# EAGLE design buscontroller (EAGLE 5.06)
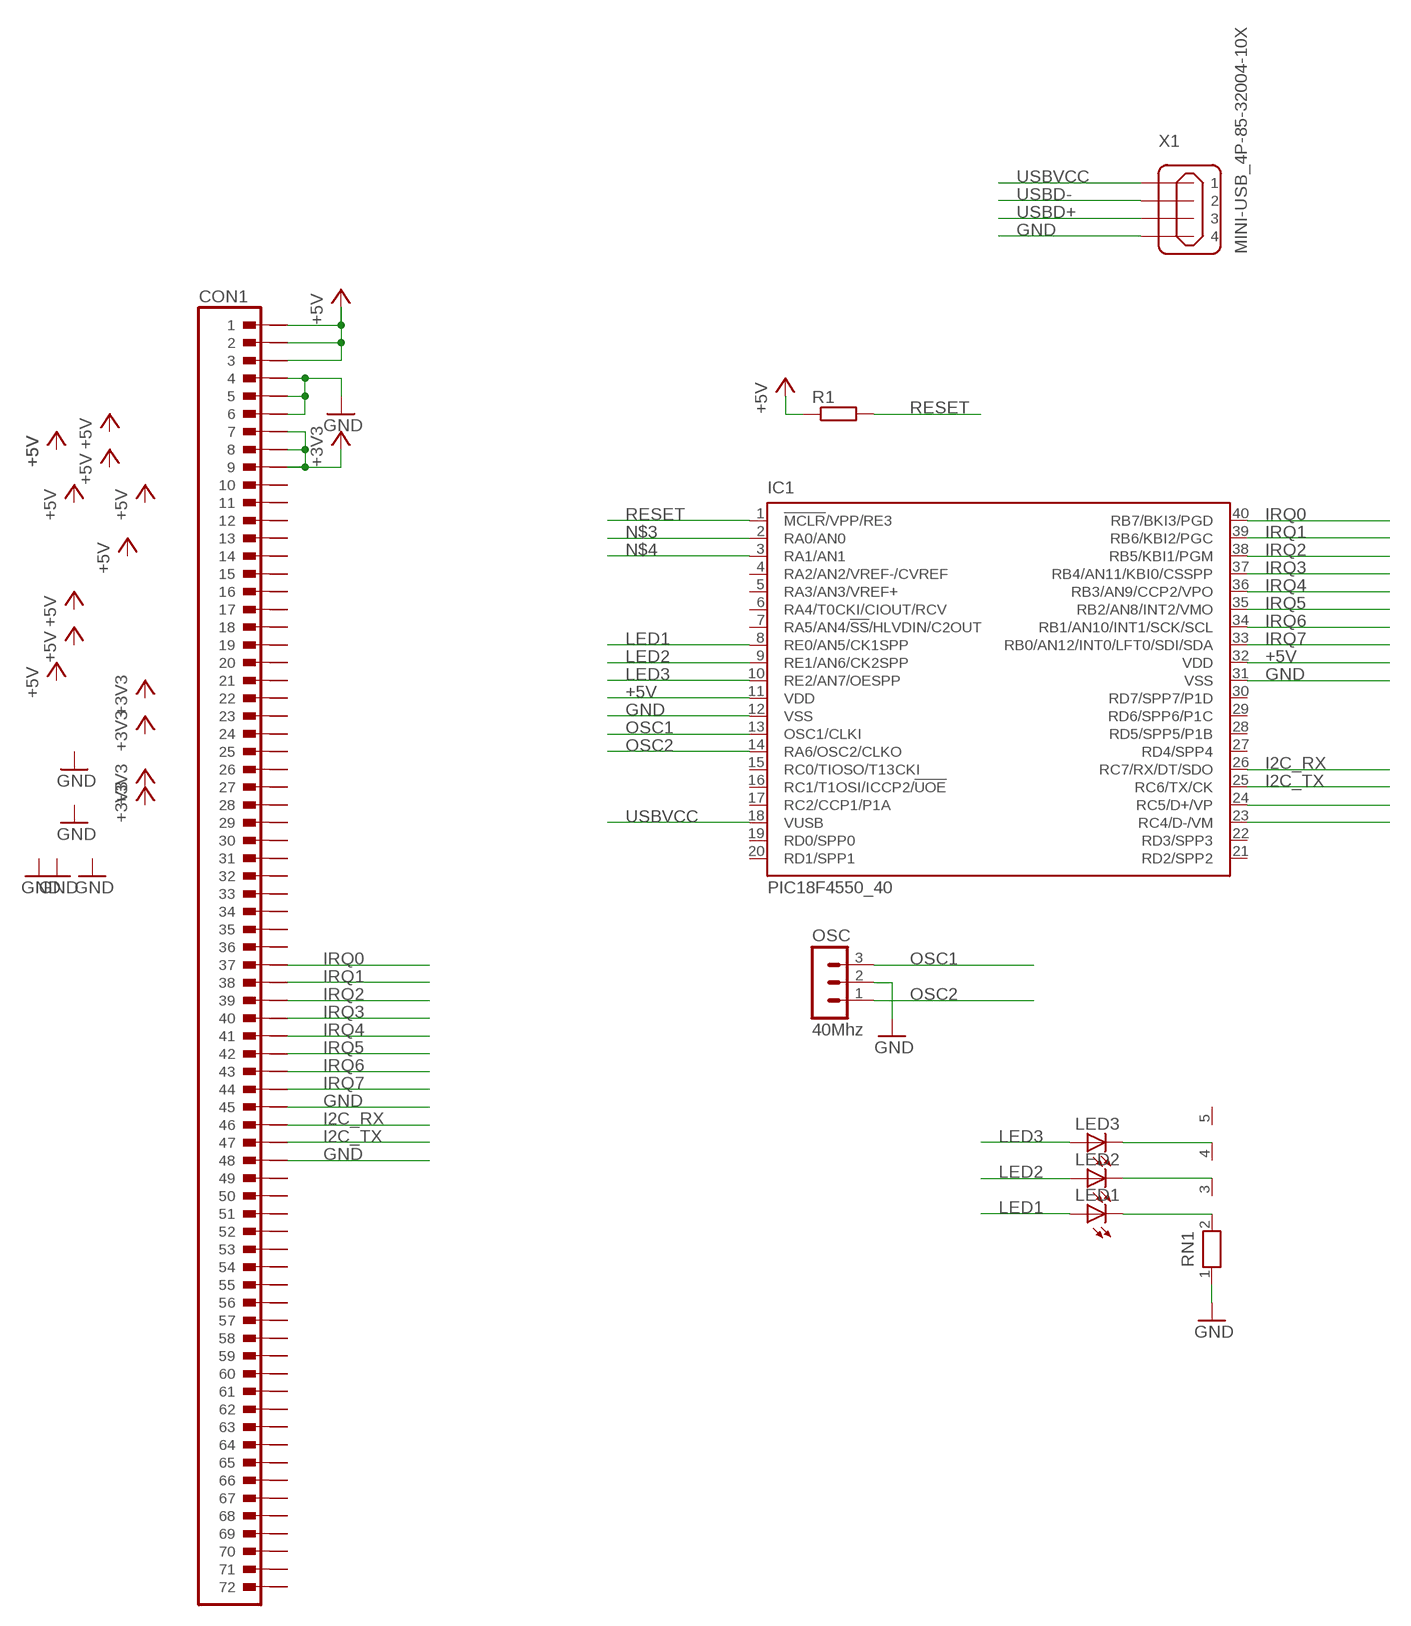
[diagram p0: schematic, sheet 1]

## Parts
CON1  SIMII72  [SIMM72R]
IC1  PIC18F4550_40  [DIL40]
LED1  LEDB155  [Q62902-B155]
LED2  LEDB155  [Q62902-B155]
LED3  LEDB155  [Q62902-B155]
OSC  40Mhz  MA03-1  [MA03-1]
R1  R-EU_0207/10  [0207/10]
RN1  RN04  [RN-5]
X1  MINI-USB_4P-85-32004-10X  [85-32004-10X]

## Nets
+3V3: CON1.7 CON1.8 CON1.9
+5V: CON1.1 CON1.2 CON1.3 IC1.11(VDD) IC1.32(VDD) R1.1
GND: CON1.4 CON1.5 CON1.6 CON1.45 CON1.48 IC1.12(VSS) IC1.31(VSS) OSC.2 RN1.1 X1.4
I2C_RX: CON1.46 IC1.26(RC7/RX/DT/SDO)
I2C_TX: CON1.47 IC1.25(RC6/TX/CK)
IRQ0: CON1.37 IC1.40(RB7/BKI3/PGD)
IRQ1: CON1.38 IC1.39(RB6/KBI2/PGC)
IRQ2: CON1.39 IC1.38(RB5/KBI1/PGM)
IRQ3: CON1.40 IC1.37(RB4/AN11/KBI0/CSSPP)
IRQ4: CON1.41 IC1.36(RB3/AN9/CCP2/VPO)
IRQ5: CON1.42 IC1.35(RB2/AN8/INT2/VMO)
IRQ6: CON1.43 IC1.34(RB1/AN10/INT1/SCK/SCL)
IRQ7: CON1.44 IC1.33(RB0/AN12/INT0/LFT0/SDI/SDA)
LED1: IC1.8(RE0/AN5/CK1SPP) LED1.A
LED2: IC1.9(RE1/AN6/CK2SPP) LED2.A
LED3: IC1.10(RE2/AN7/OESPP) LED3.A
N$1: LED1.K(C) RN1.2
N$2: LED2.K(C) RN1.3
N$3: IC1.2(RA0/AN0)
N$4: IC1.3(RA1/AN1)
N$5: LED3.K(C) RN1.4
OSC1: IC1.13(OSC1/CLKI) OSC.3
OSC2: IC1.14(RA6/OSC2/CLKO) OSC.1
RESET: IC1.1(!MCLR!/VPP/RE3) R1.2
USBD+: IC1.24(RC5/D+/VP) X1.3
USBD-: IC1.23(RC4/D-/VM) X1.2
USBVCC: IC1.18(VUSB) X1.1
Unconnected: CON1.10 CON1.11 CON1.12 CON1.13 CON1.14 CON1.15 CON1.16 CON1.17 CON1.18 CON1.19 CON1.20 CON1.21 CON1.22 CON1.23 CON1.24 CON1.25 CON1.26 CON1.27 CON1.28 CON1.29 CON1.30 CON1.31 CON1.32 CON1.33 CON1.34 CON1.35 CON1.36 CON1.49 CON1.50 CON1.51 CON1.52 CON1.53 CON1.54 CON1.55 CON1.56 CON1.57 CON1.58 CON1.59 CON1.60 CON1.61 CON1.62 CON1.63 CON1.64 CON1.65 CON1.66 CON1.67 CON1.68 CON1.69 CON1.70 CON1.71 CON1.72 CON1.73 CON1.74 CON1.75 CON1.76 CON1.77 CON1.78 CON1.79 CON1.80 CON1.81 CON1.82 CON1.83 CON1.84 CON1.85 CON1.86 CON1.87 CON1.88 CON1.89 CON1.90 CON1.91 CON1.92 CON1.93 CON1.94 CON1.95 CON1.96 CON1.97 CON1.98 CON1.99 CON1.100 CON1.101 CON1.102 CON1.103 CON1.104 CON1.105 CON1.106 CON1.107 CON1.108 CON1.109 CON1.110 CON1.111 CON1.112 CON1.113 CON1.114 CON1.115 CON1.116 CON1.117 CON1.118 CON1.119 CON1.120 CON1.121 CON1.122 CON1.123 CON1.124 CON1.125 CON1.126 CON1.127 CON1.128 CON1.129 CON1.130 CON1.131 CON1.132 CON1.133 CON1.134 CON1.135 CON1.136 CON1.137 CON1.138 CON1.139 CON1.140 CON1.141 CON1.142 CON1.143 CON1.144 IC1.4(RA2/AN2/VREF-/CVREF) IC1.5(RA3/AN3/VREF+) IC1.6(RA4/T0CKI/CIOUT/RCV) IC1.7(RA5/AN4/!SS!/HLVDIN/C2OUT) IC1.15(RC0/TIOSO/T13CKI) IC1.16(RC1/T1OSI/ICCP2/!UOE) IC1.17(RC2/CCP1/P1A) IC1.19(RD0/SPP0) IC1.20(RD1/SPP1) IC1.21(RD2/SPP2) IC1.22(RD3/SPP3) IC1.27(RD4/SPP4) IC1.28(RD5/SPP5/P1B) IC1.29(RD6/SPP6/P1C) IC1.30(RD7/SPP7/P1D) RN1.5

## Library data of the parts
CON1 = con-amp:SIMII72: AMP connector
IC1 = microchip:PIC18F4*_40: USB Microcontrollers with nanoWatt Technology High-Performance, Enhanced Flash, 28/40/44-Pin, Source: http://ww1.microchip.com/downloads/en/devicedoc/39632c.pdf
LED1-LED3 = led:LED: LED OSRAM: - CHIPLED LG R971, LG N971, LY N971, LG Q971, LY Q971, LO R971, LY R971 LH N974, LH R974 LS Q976, LO Q976, LY Q976 LO Q996 - Hyper CHIPLED LW Q18S LB Q993, LB Q99A, LB R99A - SideLED LS A670, LO A670, LY A670, LG A670, LP A670 LB A673, LV A673, LT A673, LW A673 LH A674 LY A675 LS A676, LA A676, LO A676, LY A676, LW A676 LS A679, LY A679, LG A679 - Hyper Micro SIDELED® LS Y876, LA Y876, LO Y876, LY Y876 LT Y87S - SmartLED LW L88C, LW L88S LB L89C, LB L89S, LG L890 LS L89K, LO L89K, LY L89K LS L896, LA L896, LO L896, LY L896 - TOPLED LS T670, LO T670, LY T670, LG T670, LP T670 LSG T670, LSP T670, LSY T670, LOP T670, LYG T670 LG T671, LOG T671, LSG T671 LB T673, LV T673, LT T673, LW T673 LH T674 LS T676, LA T676, LO T676, LY T676, LB T676, LH T676, LSB T676, LW T676 LB T67C, LV T67C, LT T67C, LS T67K, LO T67K, LY T67K, LW E67C LS E67B, LA E67B, LO E67B, LY E67B, LB E67C, LV E67C, LT E67C LW T67C LS T679, LY T679, LG T679 LS T770, LO T770, LY T770, LG T770, LP T770 LB T773, LV T773, LT T773, LW T773 LH T774 LS E675, LA E675, LY E675, LS T675 LS T776, LA T776, LO T776, LY T776, LB T776 LHGB T686 LT T68C, LB T68C - Hyper Mini TOPLED® LB M676 - Mini TOPLED Santana® LG M470 LS M47K, LO M47K, LY M47K Source: http://www.osram.convergy.de LUXEON: - LUMILED® LXK2-PW12-R00, LXK2-PW12-S00, LXK2-PW14-U00, LXK2-PW14-V00 LXK2-PM12-R00, LXK2-PM12-S00, LXK2-PM14-U00 LXK2-PE12-Q00, LXK2-PE12-R00, LXK2-PE12-S00, LXK2-PE14-T00, LXK2-PE14-U00 LXK2-PB12-K00, LXK2-PB12-L00, LXK2-PB12-M00, LXK2-PB14-N00, LXK2-PB14-P00, LXK2-PB14-Q00 LXK2-PR12-L00, LXK2-PR12-M00, LXK2-PR14-Q00, LXK2-PR14-R00 LXK2-PD12-Q00, LXK2-PD12-R00, LXK2-PD12-S00 LXK2-PH12-R00, LXK2-PH12-S00 LXK2-PL12-P00, LXK2-PL12-Q00, LXK2-PL12-R00 Source: www.luxeon.com KINGBRIGHT: KA-3528ASYC Source: www.kingbright.com
OSC = con-lstb:MA03-1: PIN HEADER
R1 = rcl:R-EU_: RESISTOR, European symbol
RN1 = resistor-net:RN04: RESISTOR NETWORK
X1 = con-cypressindustries:MINI-USB_4P-: MINI USB 4 Pol. Source: www.cypressindustries.com

## Board
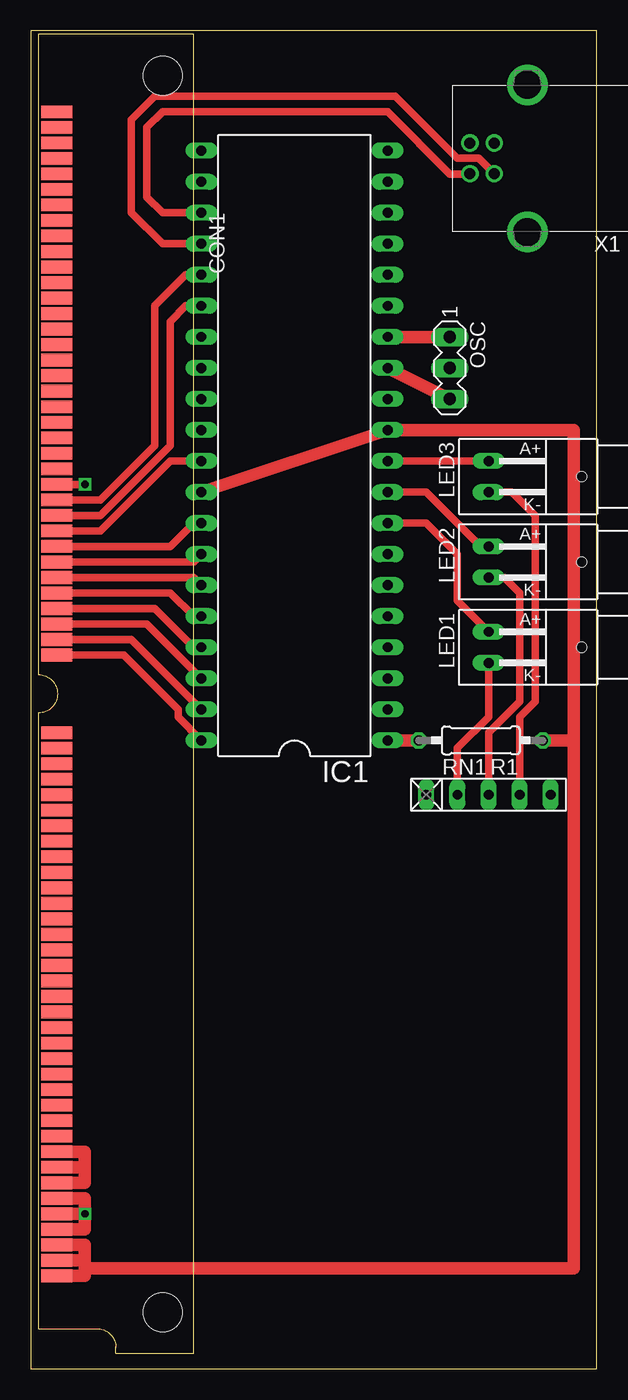
[diagram p1: board, top side]
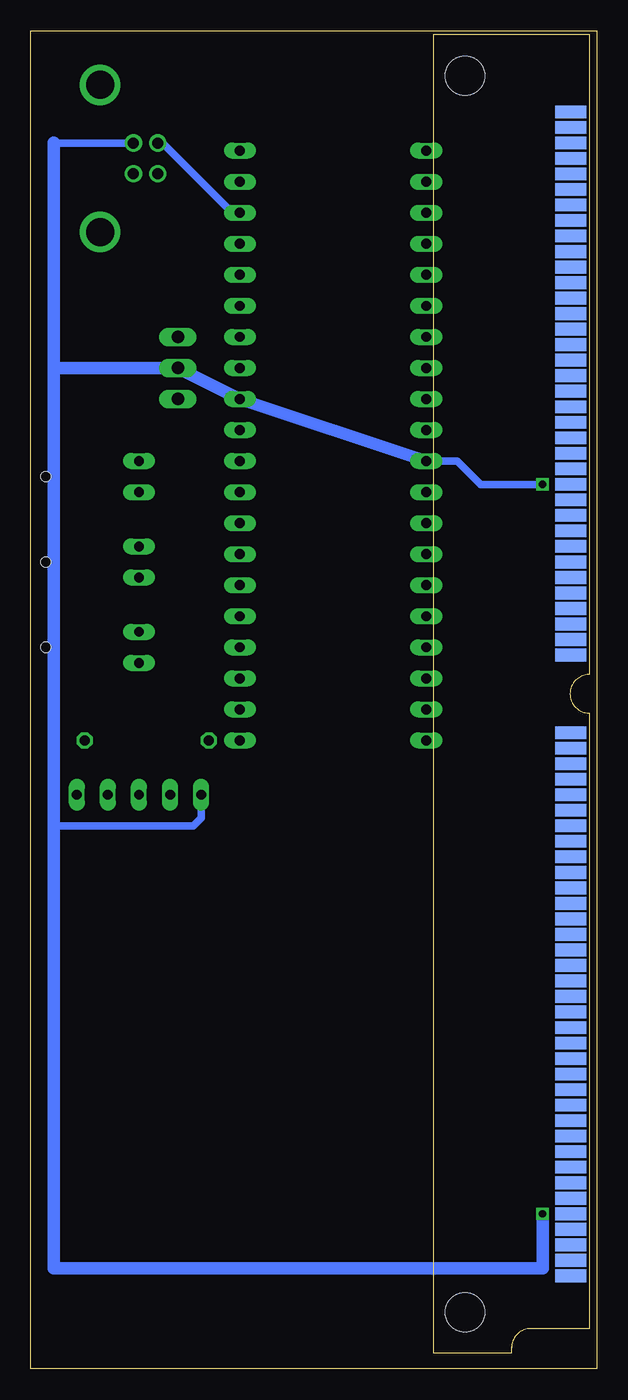
[diagram p2: board, bottom side, seen from below]

Size 46.34 x 109.53 mm. Coordinates in mm from the lower left corner, seen from the top.
Outline: 0,0 46.34,0 46.34,109.53 0,109.53 0,0
Copper layers (1*16): Top 0.035mm / dielectric 1.5mm / Bottom 0.035mm
Design rules "default": minimum track width 10mil, minimum drill 24mil, track to track 8mil, track to pad 8mil, pad to pad 8mil, via to via 8mil, smd to smd 8mil, copper to edge 40mil, drill to drill 8mil, minimum pad ring 10mil, minimum via ring 8mil, stop-mask expansion 4mil, vias tented up to drill 0mil, thermal gap 10mil

### Footprints (pad centres in the part's own frame; a part is rotated, then mirrored left to right if it is on the bottom)
SIMM72R = smd 1.041 x 2.54: 1 47.625,-8.636; 2 46.355,-8.636; 3 45.085,-8.636; 4 43.815,-8.636; 5 42.545,-8.636; 6 41.275,-8.636; 7 40.005,-8.636; 8 38.735,-8.636; 9 37.465,-8.636; 10 36.195,-8.636; 11 34.925,-8.636; 12 33.655,-8.636; 13 32.385,-8.636; 14 31.115,-8.636; 15 29.845,-8.636; 16 28.575,-8.636; 17 27.305,-8.636; 18 26.035,-8.636; 19 24.765,-8.636; 20 23.495,-8.636; 21 22.225,-8.636; 22 20.955,-8.636; 23 19.685,-8.636; 24 18.415,-8.636; 25 17.145,-8.636; 26 15.875,-8.636; 27 14.605,-8.636; 28 13.335,-8.636; 29 12.065,-8.636; 30 10.795,-8.636; 31 9.525,-8.636; 32 8.255,-8.636; 33 6.985,-8.636; 34 5.715,-8.636; 35 4.445,-8.636; 36 3.175,-8.636; 37 -3.175,-8.636; 38 -4.445,-8.636; 39 -5.715,-8.636; 40 -6.985,-8.636; 41 -8.255,-8.636; 42 -9.525,-8.636; 43 -10.795,-8.636; 44 -12.065,-8.636; 45 -13.335,-8.636; 46 -14.605,-8.636; 47 -15.875,-8.636; 48 -17.145,-8.636; 49 -18.415,-8.636; 50 -19.685,-8.636; 51 -20.955,-8.636; 52 -22.225,-8.636; 53 -23.495,-8.636; 54 -24.765,-8.636; 55 -26.035,-8.636; 56 -27.305,-8.636; 57 -28.575,-8.636; 58 -29.845,-8.636; 59 -31.115,-8.636; 60 -32.385,-8.636; 61 -33.655,-8.636; 62 -34.925,-8.636; 63 -36.195,-8.636; 64 -37.465,-8.636; 65 -38.735,-8.636; 66 -40.005,-8.636; 67 -41.275,-8.636; 68 -42.545,-8.636; 69 -43.815,-8.636; 70 -45.085,-8.636; 71 -46.355,-8.636; 72 -47.625,-8.636 | smd 1.041 x 2.54 bottom: 73 47.625,-8.636; 74 46.355,-8.636; 75 45.085,-8.636; 76 43.815,-8.636; 77 42.545,-8.636; 78 41.275,-8.636; 79 40.005,-8.636; 80 38.735,-8.636; 81 37.465,-8.636; 82 36.195,-8.636; 83 34.925,-8.636; 84 33.655,-8.636; 85 32.385,-8.636; 86 31.115,-8.636; 87 29.845,-8.636; 88 28.575,-8.636; 89 27.305,-8.636; 90 26.035,-8.636; 91 24.765,-8.636; 92 23.495,-8.636; 93 22.225,-8.636; 94 20.955,-8.636; 95 19.685,-8.636; 96 18.415,-8.636; 97 17.145,-8.636; 98 15.875,-8.636; 99 14.605,-8.636; 100 13.335,-8.636; 101 12.065,-8.636; 102 10.795,-8.636; 103 9.525,-8.636; 104 8.255,-8.636; 105 6.985,-8.636; 106 5.715,-8.636; 107 4.445,-8.636; 108 3.175,-8.636; 109 -3.175,-8.636; 110 -4.445,-8.636; 111 -5.715,-8.636; 112 -6.985,-8.636; 113 -8.255,-8.636; 114 -9.525,-8.636; 115 -10.795,-8.636; 116 -12.065,-8.636; 117 -13.335,-8.636; 118 -14.605,-8.636; 119 -15.875,-8.636; 120 -17.145,-8.636; 121 -18.415,-8.636; 122 -19.685,-8.636; 123 -20.955,-8.636; 124 -22.225,-8.636; 125 -23.495,-8.636; 126 -24.765,-8.636; 127 -26.035,-8.636; 128 -27.305,-8.636; 129 -28.575,-8.636; 130 -29.845,-8.636; 131 -31.115,-8.636; 132 -32.385,-8.636; 133 -33.655,-8.636; 134 -34.925,-8.636; 135 -36.195,-8.636; 136 -37.465,-8.636; 137 -38.735,-8.636; 138 -40.005,-8.636; 139 -41.275,-8.636; 140 -42.545,-8.636; 141 -43.815,-8.636; 142 -45.085,-8.636; 143 -46.355,-8.636; 144 -47.625,-8.636 | hole 3.175: -50.597,0; 50.597,0
DIL40 = drill 0.813 long: 1 -24.13,-7.62; 2 -21.59,-7.62; 3 -19.05,-7.62; 4 -16.51,-7.62; 5 -13.97,-7.62; 6 -11.43,-7.62; 7 -8.89,-7.62; 8 -6.35,-7.62; 9 -3.81,-7.62; 10 -1.27,-7.62; 11 1.27,-7.62; 12 3.81,-7.62; 13 6.35,-7.62; 14 8.89,-7.62; 15 11.43,-7.62; 16 13.97,-7.62; 17 16.51,-7.62; 18 19.05,-7.62; 19 21.59,-7.62; 20 24.13,-7.62; 21 24.13,7.62; 22 21.59,7.62; 23 19.05,7.62; 24 16.51,7.62; 25 13.97,7.62; 26 11.43,7.62; 27 8.89,7.62; 28 6.35,7.62; 29 3.81,7.62; 30 1.27,7.62; 31 -1.27,7.62; 32 -3.81,7.62; 33 -6.35,7.62; 34 -8.89,7.62; 35 -11.43,7.62; 36 -13.97,7.62; 37 -16.51,7.62; 38 -19.05,7.62; 39 -21.59,7.62; 40 -24.13,7.62
Q62902-B155 = drill 0.813 long: A 7.62,-1.27; K 7.62,1.27 | hole 0.813: 0,0
MA03-1 = drill 1.016 long: 1 -2.54,0; 2 0,0; 3 2.54,0
0207/10 = drill 0.813 octagon: 1 -5.08,0; 2 5.08,0
RN-5 = drill 0.813 long: 1 -5.08,0; 2 -2.54,0; 3 0,0; 4 2.54,0; 5 5.08,0
85-32004-10X = drill 0.92 pad 1.27 round: 1 4.71,-1.25; 2 4.71,1.25; 3 2.71,1.25; 4 2.71,-1.25 | drill 2.3 pad 3 round: M1 0,6.02; M2 0,-6.02

### Placement (x,y rotation side)
CON1  10.79,55.24 270 top
IC1  21.59,75.57 90 top
LED1  45.09,59.05 180 top
LED2  45.09,66.04 180 top
LED3  45.09,73.03 180 top
OSC  34.29,81.92 270 top
R1  36.83,51.43 180 top
RN1  37.47,46.99 0 top
X1  40.64,99.06 180 top

### Tracks (layer width: path | path; a pad name or v marks a point on that pad's centre or on a via)
+3V3
  Top 1.016: CON1.9 4.45,17.78 4.45,17.15 | CON1.7 4.45,15.24 4.45,17.15 | CON1.8 4.45,16.51 4.45,17.15
+5V
  Top 1.016: 4.45,8.26 4.45,7.62 CON1.1 | CON1.3 4.45,10.16 4.45,8.89 | 4.45,8.89 CON1.2 | 4.45,8.26 4.45,8.89 | 4.45,8.26 44.45,8.26 44.45,51.43 | 44.45,51.43 44.45,76.84 IC1.11 IC1.32 | 44.45,51.43 R1.1
GND  (via drill 0.6)
  Top 0.61: CON1.45 5.71,68.58 11.43,74.3 IC1.31 | v4.45,72.39 CON1.48
  Top 1.016: CON1.4 4.45,11.43 v4.45,12.7 | CON1.6 4.45,13.97 v4.45,12.7 | CON1.5 v4.45,12.7
  Bottom 0.61: v4.45,72.39 9.53,72.39 11.43,74.3 IC1.31 | RN1.1 32.38,45.09 33.02,44.45 44.45,44.45 | X1.4 44.43,100.31 44.45,100.33
  Bottom 1.016: v4.45,12.7 4.45,8.26 44.45,8.26 44.45,44.45 44.45,81.92 | 44.45,81.92 OSC.2 IC1.12 IC1.31 | 44.45,81.92 44.45,100.33
I2C_RX
  Top 0.61: CON1.46 5.71,69.85 11.43,75.57 11.43,85.73 12.7,87 IC1.26
I2C_TX
  Top 0.61: CON1.47 5.71,71.12 10.16,75.57 10.16,87 12.7,89.54 IC1.25
IRQ0
  Top 0.61: CON1.37 7.62,58.42 12.06,53.98 12.06,53.34 IC1.40
IRQ1
  Top 0.61: CON1.38 8.26,59.69 IC1.39
IRQ2
  Top 0.61: CON1.39 9.53,60.96 IC1.38
IRQ3
  Top 0.61: CON1.40 10.16,62.23 13.34,59.05 IC1.37
IRQ4
  Top 0.61: CON1.41 11.43,63.5 13.34,61.59 IC1.36
IRQ5
  Top 0.61: CON1.42 13.34,64.77 IC1.35
IRQ6
  Top 0.61: CON1.43 13.34,66.04 IC1.34
IRQ7
  Top 0.61: CON1.44 11.43,67.31 13.34,69.22 IC1.33
LED1
  Top 0.61: IC1.8 32.38,69.22 34.92,66.68 34.92,62.86 LED1.A
LED2
  Top 0.61: IC1.9 32.38,71.76 36.83,67.31 LED2.A
LED3
  Top 0.61: IC1.10 LED3.A
N$1
  Top 0.61: LED1.K 37.47,53.34 34.92,50.8 RN1.2
N$2
  Top 0.61: LED2.K 38.73,64.77 40.01,63.5 40.01,54.61 37.47,52.07 RN1.3
N$5
  Top 0.61: LED3.K 39.37,71.76 41.27,69.85 41.27,54.61 40.01,53.34 RN1.4
OSC1
  Top 1.016: IC1.13 OSC.3
OSC2
  Top 1.016: IC1.14 OSC.1
RESET
  Top 1.016: IC1.1 R1.2
USBD+
  Top 0.61: IC1.24 10.79,92.08 8.26,94.62 8.26,102.23 10.16,104.14 29.84,104.14 34.92,99.06 36.68,99.06 X1.3
USBD-
  Top 0.61: IC1.23 10.79,94.62 9.53,95.89 9.53,101.6 10.79,102.87 29.21,102.87 34.29,97.79 35.91,97.79 X1.2
USBVCC
  Bottom 0.61: X1.1 35.54,100.31 29.84,94.62 IC1.18